# EAGLE design Encoder_velocistaEdu (EAGLE 6.5.0)
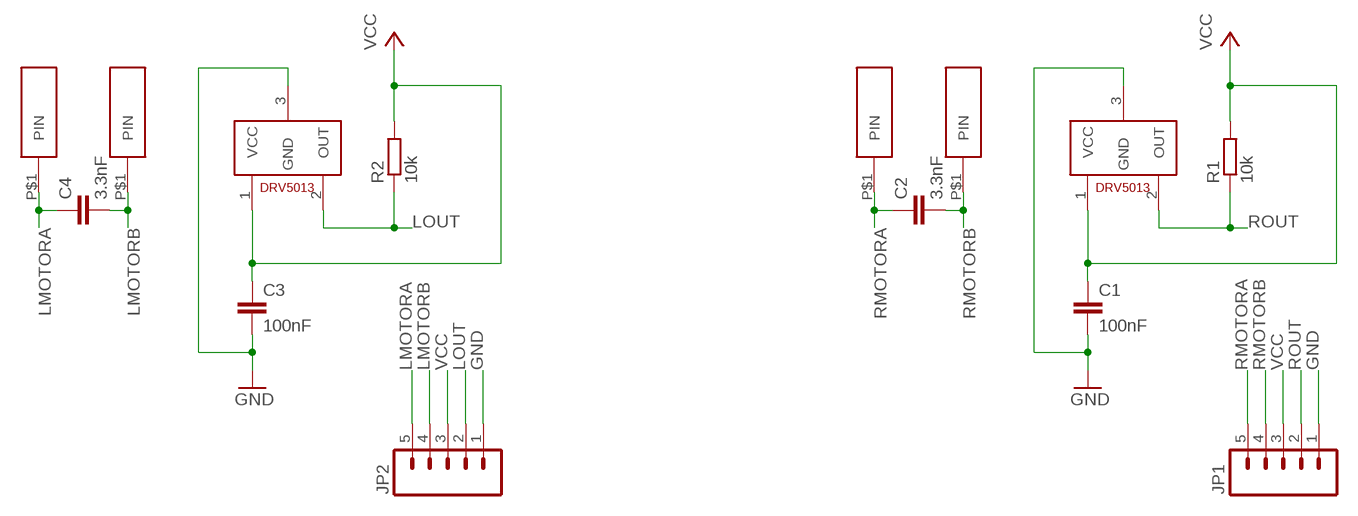
[diagram p0: schematic, sheet 1]

## Parts
C1  100nF  C-EUC0805  [C0805]
C2  3.3nF  C-EUC0805  [C0805]
C3  100nF  C-EUC0805  [C0805]
C4  3.3nF  C-EUC0805  [C0805]
JP1  M05PTH  [1X05]
JP2  M05PTH  [1X05]
R1  10k  R-EU_M0805  [M0805]
R2  10k  R-EU_M0805  [M0805]
U$1  DRV5013  [DBZ_R-PDSO-G3]
U$2  TERMINAL_MOTOR_N20  [TERMINAL_MOTOR_N20]
U$3  TERMINAL_MOTOR_N20  [TERMINAL_MOTOR_N20]
U$4  TERMINAL_MOTOR_N20  [TERMINAL_MOTOR_N20]
U$5  TERMINAL_MOTOR_N20  [TERMINAL_MOTOR_N20]
U$6  DRV5013  [DBZ_R-PDSO-G3]

## Nets
GND: C1.2 C3.2 JP1.1 JP2.1 U$1.3(GND) U$6.3(GND)
LMOTORA: C4.1 JP2.5 U$4.P$1(PIN)
LMOTORB: C4.2 JP2.4 U$5.P$1(PIN)
LOUT: JP2.2 R2.1 U$6.2(OUT)
RMOTORA: C2.1 JP1.5 U$2.P$1(PIN)
RMOTORB: C2.2 JP1.4 U$3.P$1(PIN)
ROUT: JP1.2 R1.1 U$1.2(OUT)
VCC: C1.1 C3.1 JP1.3 JP2.3 R1.2 R2.2 U$1.1(VCC) U$6.1(VCC)

## Library data of the parts
C1-C4 = resistor:C-EU: CAPACITOR, European symbol
JP1 JP2 = SparkFun:M05: Header 5 Standard 5-pin 0.1" header. Use with straight break away headers (SKU : PRT-00116), right angle break away headers (PRT-00553), swiss pins (PRT-00743), machine pins (PRT-00117), and female headers (PRT-00115). Molex polarized connector foot print use with SKU : PRT-08230 with associated crimp pins and housings.
R1 R2 = resistor:R-EU_: RESISTOR, European symbol
U$1 U$6 = texas:DRV5013
U$2-U$5 = ARE_connectors:TERMINAL_MOTOR_N20

## Board
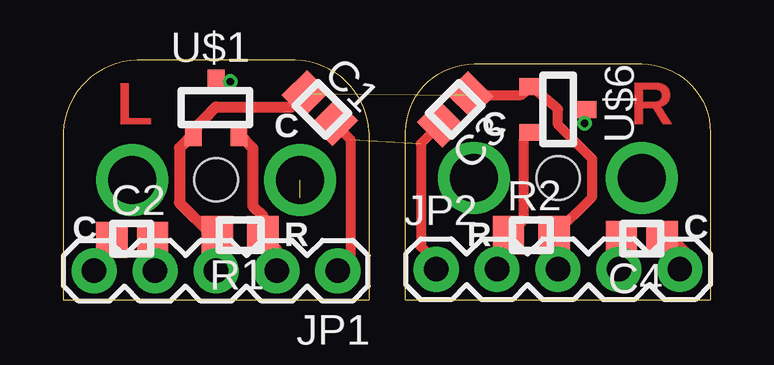
[diagram p1: board, top side]
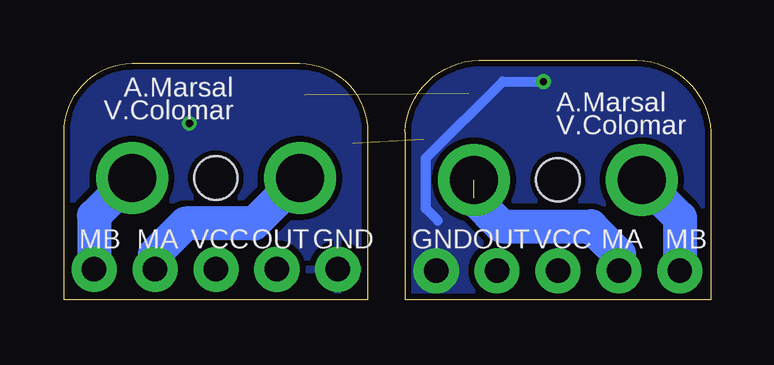
[diagram p2: board, bottom side, seen from below]

Size 26.99 x 10.01 mm. Coordinates in mm from the lower left corner, seen from the top.
Outline: 9.38,10 3.38,10 arc90 0,7 0,0 12.76,0 12.76,7 arc90 9.38,10
Outline: 14.29,0 26.99,0 26.99,6.99 arc90 24.13,9.84 17.14,9.84 arc90 14.29,6.99 14.29,0
Copper layers (1*16): Top 0.035mm / dielectric 1.5mm / Bottom 0.035mm
Design rules "Elecrow_2-layer_eagle_rule": minimum track width 6mil, minimum drill 12mil, track to track 6mil, track to pad 6mil, pad to pad 6mil, via to via 6mil, smd to smd 0mil, copper to edge 10mil, drill to drill 10mil, minimum pad ring 10mil, minimum via ring 6mil, stop-mask expansion 2mil, vias tented up to drill 100mil, thermal gap 10mil
Holes 1.8 mm at 6.38,5 20.64,5.08

### Footprints (pad centres in the part's own frame; a part is rotated, then mirrored left to right if it is on the bottom)
C0805 = smd 1.3 x 1.5: 1 -0.85,0; 2 0.85,0
1X05 = drill 1.016 pad 1.88: 1 0,0; 2 2.54,0; 3 5.08,0; 4 7.62,0; 5 10.16,0
M0805 = smd 1.3 x 1.6: 1 -0.95,0; 2 0.95,0
DBZ_R-PDSO-G3 = smd 0.7 x 1: 1 -0.95,-1.1; 2 0.95,-1.1; 3 0,1.1
TERMINAL_MOTOR_N20 = drill 2 pad 3: P$1 0,0

### Placement (x,y rotation side)
C1  10.7,8 315 top
C2  2.89,2.5 0 top
C3  16.35,7.94 225 top
C4  24.13,2.54 180 top
JP1  11.45,1.21 180 top
JP2  15.56,1.27 0 top
R1  7.38,2.7 180 top
R2  19.53,2.7 0 top
U$1  6.38,8 0 top
U$2  2.88,5 0 top
U$3  9.88,5 0 top
U$4  24.14,5.08 0 top
U$5  17.14,5.08 0 top
U$6  20.64,7.94 270 top

### Tracks (layer width: path | path; a pad name or v marks a point on that pad's centre or on a via)
GND  (via drill 0.3 pad 0.61)  (1 unrouted)
  Top 0.406: v6.98,9.1 U$1.3 | C1.2 11.98,6.68 11.98,1.73 JP1.1 | C3.2 14.92,6.51 14.92,2.22 15.56,1.59 JP2.1 | v21.74,7.36 21.74,7.67 U$6.3
  Bottom 0.406: 11.38,3.3 11.88,3.8 11.88,5.9 8.68,9.1 v6.98,9.1
  pour Bottom (isolate 0.254, no thermals): -0.03,-0.02 12.74,-0.02 12.76,7.13 arc90 9.38,10 3.18,10 arc90 0,7.33
  pour Bottom (isolate 0.254): 14.29,0 26.99,0 26.99,9.84 14.29,9.84
LMOTORA
  Top 1.016: C4.1 25.72,1.8 JP2.5
  Bottom 1.422: U$4.P$1 25.72,3.5 JP2.5
LMOTORB
  Top 1.016: C4.2 23.18,2.44 JP2.4
  Bottom 1.422: U$5.P$1 19.05,3.17 21.91,3.17 23.18,1.91 JP2.4
LOUT
  Top 0.406: JP2.2 18.58,1.75 R2.1 19.21,3.33 19.21,5.71 19.22,6.68 U$6.2
RMOTORA
  Top 0.406: JP1.5 2.04,1.95 C2.1
  Bottom 1.422: U$2.P$1 1.29,3.41 JP1.5
RMOTORB  (1 unrouted)
  Top 0.406: C2.2 3.83,2.41 JP1.4
  Bottom 1.422: 9.88,4.24 8.7,3.06 5,3.06 3.83,1.9 JP1.4
ROUT
  Top 0.406: R1.1 8.91,2.12 JP1.2
  Top 0.457: U$1.2 7.91,6.32 7.91,3.92 8.33,3.5 R1.1
VCC  (1 unrouted)
  Top 0.406: U$1.1 5.43,7.05 | 9.53,8.04 C1.1 | C3.1 19.1,8.54 U$6.1 20.64,7.95 20.64,7.3 22.07,5.87 22.07,4.29 R2.2 20.48,1.43 JP2.3 | R1.2 6.37,2.64 JP1.3
  Top 0.457: 5.43,7.05 6.36,8.04 9.53,8.04 | U$1.1 4.86,6.33 4.86,4.05 6.21,2.7 R1.2

### Text on the board
Top: L | R
_tsilk: C | C | C | C | R | R
_bsilk: A.Marsal | A.Marsal | V.Colomar | V.Colomar | MB | MA | VCC | OUT | GND | GND | OUT | VCC | MA | MB